# EAGLE design display-coln (EAGLE 9.1.0)
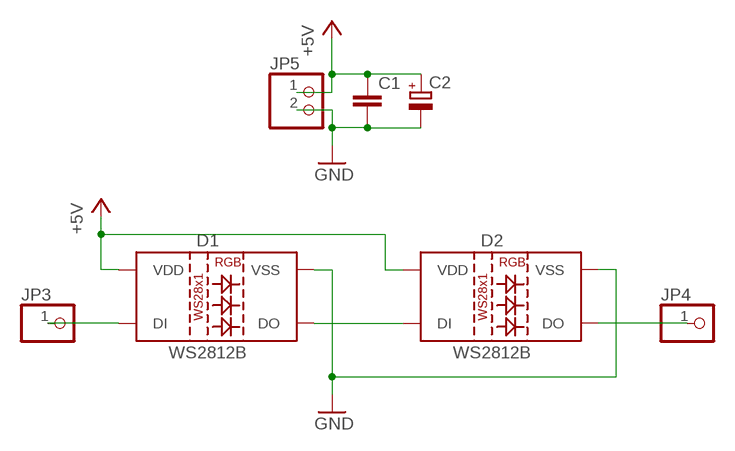
[diagram p0: schematic, sheet 1]

## Parts
C1  C-EUC1206  [C1206]
C2  CPOL-EUE2.5-6  [E2,5-6]
D1  WS2812B  [WS2812B]
D2  WS2812B  [WS2812B]
JP3  PINHD-1X1  [1X01]
JP4  PINHD-1X1  [1X01]
JP5  PINHD-1X2  [1X02]

## Nets
+5V: C1.1 C2.+ D1.1(VDD) D2.1(VDD) JP5.1
GND: C1.2 C2.- D1.3(VSS) D2.3(VSS) JP5.2
N$1: D2.2(DO) JP4.1
N$3: D1.2(DO) D2.4(DI)
N$15: D1.4(DI) JP3.1

## Library data of the parts
C1 = rcl:C-EU: CAPACITOR, European symbol; SPICEPREFIX: C
C2 = rcl:CPOL-EU: POLARIZED CAPACITOR, European symbol; SPICEPREFIX: C
D1 D2 = WS2812B:WS2812B: WS2812B SMD addressable RGB LED 5x5mm SMD LED with built-in controller IC. Color: Red/Green/Blue mC Rating: RGB: 390, 660, 180 mcd Forward Voltage: RGB: 2.0, 3.0, 3.0 V Packages:WS2812B SparkFun Products: Blynk Board - ESP8266 <https://www.sparkfun.com/products/13794>; AVAILABILITY: Unavailable; DESCRIPTION: Intelligent Control Led Integrated Light Source Pack Of 10; MF: Worldsemi; MP: WS2812B; PACKAGE: None; PRICE: None
JP3 JP4 = pinhead:PINHD-1X1: PIN HEADER
JP5 = pinhead:PINHD-1X2: PIN HEADER

## Board
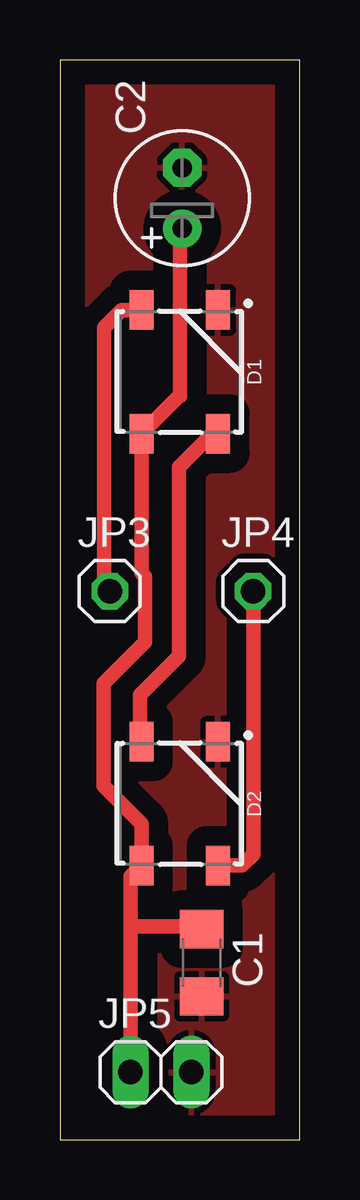
[diagram p1: board, top side]

Size 10 x 45 mm. Coordinates in mm from the lower left corner, seen from the top.
Outline: 10,0 10,45 0,45 0,0 10,0
Copper layers (1*16): Top 0.035mm / dielectric 1.5mm / Bottom 0.035mm
Design rules "default *": minimum track width 6mil, minimum drill 0.35mm, track to track 32mil, track to pad 16mil, pad to pad 24mil, via to via 6mil, smd to smd 6mil, copper to edge 40mil, drill to drill 6mil, minimum pad ring 10mil, minimum via ring 8mil, stop-mask expansion 4mil, vias tented up to drill 0mil, thermal gap 10mil

### Footprints (pad centres in the part's own frame; a part is rotated, then mirrored left to right if it is on the bottom)
C1206 = smd 1.6 x 1.8: 1 -1.4,0; 2 1.4,0
E2,5-6 = drill 0.813 pad 1.6: + -1.27,0 | drill 0.813 pad 1.6 octagon: - 1.27,0
WS2812B = smd 1.651 x 1: 1 2.577,-1.6; 2 2.577,1.6; 3 -2.577,1.6; 4 -2.577,-1.6
1X01 = drill 1.016 octagon: 1 0,0
1X02 = drill 1.016 long: 1 -1.27,0; 2 1.27,0

### Placement (x,y rotation side)
C1  5.92,7.37 270 top
C2  5.1,39.24 90 top
D1  5,32 270 top
D2  5,14 270 top
JP3  2.08,22.86 0 top
JP4  8.07,22.86 0 top
JP5  4.21,2.81 0 top

### Tracks (layer width: path | path; a pad name or v marks a point on that pad's centre or on a via)
+5V
  Top 0.61: C2.+ 5,37.87 5,31 4.98,31 D1.1 3.4,23.62 3.55,23.47 3.55,20.74 1.83,19.02 1.83,14.73 3.4,13.16 D2.1 2.94,10.96 2.94,8.89 | JP5.1 2.94,8.89 | C1.1 5.8,8.89 2.94,8.89
GND
  pour Top: 0,0 9.97,0 9.97,45 0,45
N$1
  Top 0.61: JP4.1 8.07,11.89 7.6,11.42 D2.2
N$3
  Top 0.61: D2.4 3.35,16.63 3.35,17.78 3.35,18.53 4.98,20.15 4.98,28.03 6.37,29.42 D1.2
N$15
  Top 0.61: JP3.1 1.85,23.09 1.85,33.85 2.58,34.58 D1.4